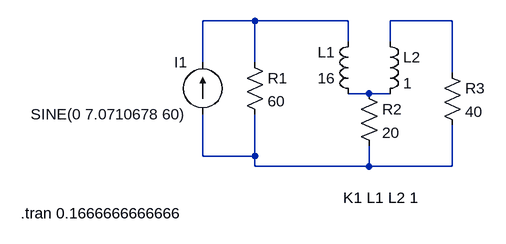
[diagram p0: schematic Draft1.asc]
Draft1.asc, the LTspice schematic file:
Version 4.1
SHEET 1 880 680
WIRE 64 64 -16 64
WIRE 208 64 64 64
WIRE 368 64 272 64
WIRE 208 96 208 64
WIRE 272 96 272 64
WIRE -16 128 -16 64
WIRE 64 128 64 64
WIRE 368 144 368 64
WIRE 240 176 208 176
WIRE 272 176 240 176
WIRE -16 272 -16 208
WIRE 64 272 64 208
WIRE 64 272 -16 272
WIRE 64 288 64 272
WIRE 240 288 240 256
WIRE 240 288 64 288
WIRE 368 288 368 224
WIRE 368 288 240 288
SYMBOL current -16 208 R180
WINDOW 0 24 80 Left 2
WINDOW 3 24 0 Left 2
WINDOW 123 0 0 Left 0
WINDOW 39 0 0 Left 0
SYMATTR InstName I1
SYMATTR Value SINE(0 7.0710678 60)
SYMBOL res 48 112 R0
SYMATTR InstName R1
SYMATTR Value 60
SYMBOL ind 224 192 R180
WINDOW 0 36 80 Left 2
WINDOW 3 36 40 Left 2
SYMATTR InstName L1
SYMATTR Value 16
SYMATTR Type ind
SYMATTR SpiceLine Rser=0
SYMBOL ind 256 80 R0
SYMATTR InstName L2
SYMATTR Value 1
SYMATTR Type ind
SYMATTR SpiceLine Rser=0
SYMBOL res 224 160 R0
SYMATTR InstName R2
SYMATTR Value 20
SYMBOL res 352 128 R0
SYMATTR InstName R3
SYMATTR Value 40
TEXT 200 336 Left 2 !K1 L1 L2 1
TEXT -296 360 Left 2 !.tran 0.1666666666666

The netlist it stands for:
* Draft1.asc
I1 N004 N001 SINE(0 7.0710678 60)
R1 N001 N004 60
L1 N003 N001 16 Rser=0
L2 N002 N003 1 Rser=0
R2 N003 N004 20
R3 N002 N004 40
K1 L1 L2 1
.tran 0.1666666666666
.backanno
.end